# Altium schematic sheet driver-phase.SchDoc: Phase driver
size A3; SheetNumber: 19; SheetTotal: 21
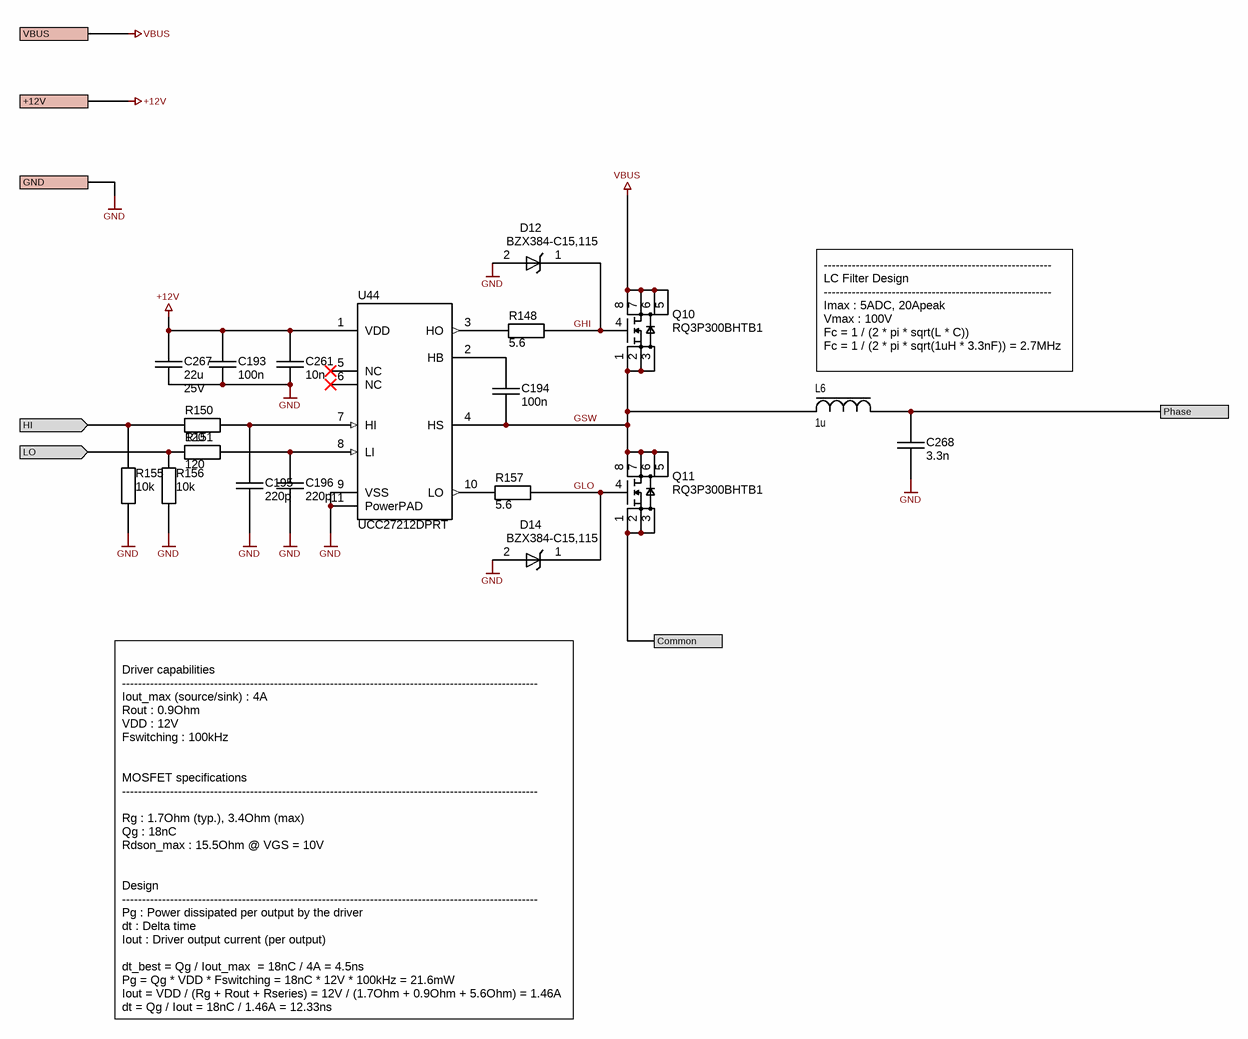
[diagram p0: driver-phase.SchDoc]

## Parts
C193  100n  [SM/C0402]
C194  100n  [SM/C0402]
C195  220p  [SM/C0402]
C196  220p  [SM/C0402]
C261  10n  [SM/C0402]
C267  22u  Voltage: 25V  [SM/C0805]
C268  3.3n  [SM/C0402]
D12  BZX384-C15,115  [SODFL250X110-2N]
D14  BZX384-C15,115  [SODFL250X110-2N]
L6  1u  [PA5005.102NLT]
Q10  RQ3P300BHTB1  [RQ3P300BHTB1]
Q11  RQ3P300BHTB1  [RQ3P300BHTB1]
R148  5.6  [SM/R0402]
R150  120  [SM/R0402]
R151  120  [SM/R0402]
R155  10k  [SM/R0402]
R156  10k  [SM/R0402]
R157  5.6  [SM/R0402]
U44  UCC27212DPRT  [PSON80P400X80_HS-11N]

## Ports
+12V, Common, GND, HI (in), LO (in), Phase, VBUS

## Nets
+12V: C193.2 C261.1 C267.2 U44.1(VDD) ; port +12V
GND: C193.1 C195.1 C196.1 C261.2 C267.1 C268.1 D12.2(A) D14.2(A) R155.2 R156.2 U44.9(VSS) U44.11(PowerPAD) ; port GND
VBUS: Q10.5(D) Q10.6(D) Q10.7(D) Q10.8(D) ; port VBUS
Common: Q11.1(S) Q11.2(S) Q11.3(S) ; port Common
GHI: D12.1(K) Q10.4(G) R148.2
GLO: D14.1(K) Q11.4(G) R157.1
GSW: C194.2 L6.1 Q10.1(S) Q10.2(S) Q10.3(S) Q11.5(D) Q11.6(D) Q11.7(D) Q11.8(D) U44.4(HS)
HI: R150.2 R155.1 ; port HI
LO: R151.2 R156.1 ; port LO
Phase: C268.2 L6.2 ; port Phase
NetC194_1: C194.1 U44.2(HB)
NetC195_2: C195.2 R150.1 U44.7(HI)
NetC196_2: C196.2 R151.1 U44.8(LI)
NetR148_1: R148.1 U44.3(HO)
NetR157_2: R157.2 U44.10(LO)

Not connected (* = marked no-connect by the designer): U44 5(NC)* 6(NC)*

## Notes on the sheet
- (near L6) ---------------------------------------------------------
  LC Filter Design
  ---------------------------------------------------------
  Imax : 5ADC, 20Apeak
  Vmax : 100V
  Fc = 1 / (2 * pi * sqrt(L * C))
  Fc = 1 / (2 * pi * sqrt(1uH * 3.3nF)) = 2.7MHz
- Driver capabilities
  --------------------------------------------------------------------------------------------------------
  Iout_max (source/sink) : 4A
  Rout : 0.9Ohm
  VDD : 12V
  Fswitching : 100kHz
  MOSFET specifications
  --------------------------------------------------------------------------------------------------------
  Rg : 1.7Ohm (typ.), 3.4Ohm (max)
  Qg : 18nC
  Rdson_max : 15.5Ohm @ VGS = 10V
  Design
  --------------------------------------------------------------------------------------------------------
  Pg : Power dissipated per output by the driver
  dt : Delta time
  Iout : Driver output current (per output)
  dt_best = Qg / Iout_max  = 18nC / 4A = 4.5ns
  Pg = Qg * VDD * Fswitching = 18nC * 12V * 100kHz = 21.6mW
  Iout = VDD / (Rg + Rout + Rseries) = 12V / (1.7Ohm + 0.9Ohm + 5.6Ohm) = 1.46A
  dt = Qg / Iout = 18nC / 1.46A = 12.33ns
- HES-SO / HEIG-VD / TIN / IAI
  Route de Cheseaux, 1
  CH-1401 Yverdon-les-Bains
  T +41 24 557 73 77    F +41 24 557 63 20
  http://iai.heig-vd.ch
  iai@heig-vd.ch
- Title
- Size
- Date
- A4
- Project
- Sheet
- of
- No.
- Author
- SVN/Git
- Version
- File

## Library data of the parts
C193 C194 = CAP CER 100NF 25V X5R 0402: 100 nF ±10% 25V Ceramic Capacitor X5R 0402 (1005 Metric); Voltage: 25V; Dielectric: X5R; Supplier 1: Digi-Key; Supplier Part Number 1: 1276-1043-1-ND; Value: 100n
C195 C196 = CAP CER 220PF 50V C0G/NP0 0402: 220 pF ±5% 50V Ceramic Capacitor C0G, NP0 0402 (1005 Metric); Dielectric: NPO; Voltage: 50V; Supplier 1: Digi-Key; Supplier Part Number 1: 1276-1059-1-ND; Value: 220p
C261 = CAP CER 10NF 50V X7R 0402: 10 nF ±10% 50V Ceramic Capacitor X7R 0402 (1005 Metric); Voltage: 50V; Dielectric: X7R; Supplier 1: Digi-Key; Supplier Part Number 1: 1276-1028-1-ND; Value: 10n
C267 = CAP CER 22UF 25V X5R 0805: 22 µF ±20% 25V Ceramic Capacitor X5R 0805 (2012 Metric); Dielectric: X5R; Supplier 1: Digi-Key; Supplier Part Number 1: 490-14661-1-ND
C268 = CAP CER 3.3NF 100V X8R 0402: 3.3 nF ±10% 100V Ceramic Capacitor X8R 0402 (1005 Metric); Voltage: 16V; Dielectric: X7R; Supplier 1: Digi-Key; Supplier Part Number 1: 445-15951-1-ND; Value: 3.3n
D12 D14 = DIODE ZENER 15V 300MW SOD323: Zener Diode 15 V 300 mW ±5% Surface Mount SOD-323; Mounting: SMD; Supplier 1: Digi-Key; Supplier Part Number 1: 1727-4986-1-ND
L6 = PA5005.102NLT: 1 µH Shielded Molded Inductor 20 A 4.52mOhm Max Nonstandard; Isat: 23A; Value: 1u; Supplier 1: Digi-Key; Supplier Part Number 1: 553-4098-1-ND
Q10 Q11 = RQ3P300BHTB1: N-Channel 100 V 39A (Ta) 2W (Ta) Surface Mount 8-HSMT (3.2x3); Supplier 1: Digi-Key; Supplier Part Number 1: 846-RQ3P300BHTB1CT-ND
R148 R157 = RES 5.6 OHM 5% 1/16W 0402: 5.6 Ohms ±5% 0.063W, 1/16W Chip Resistor 0402 (1005 Metric) Moisture Resistant Thick Film; Supplier 1: Digi-Key; Supplier Part Number 1: 311-5.6JRCT-ND; Value: 5.6
R150 R151 = RES 120 OHM 1% 1/16W 0402: 120 Ohms ±1% 0.063W, 1/16W Chip Resistor 0402 (1005 Metric) Moisture Resistant Thick Film; Supplier 1: Digi-Key; Supplier Part Number 1: 311-120LRCT-ND; Value: 120
R155 R156 = RES 10K OHM 1% 1/16W 0402: 10 kOhms ±1% 0.063W, 1/16W Chip Resistor 0402 (1005 Metric) Moisture Resistant Thick Film; Supplier 1: Digi-Key; Supplier Part Number 1: 1276-3431-1-ND; Value: 10k
U44 = UCC27212: Half-Bridge Gate Driver IC Non-Inverting 10-WSON (4x4); Supplier 1: Digi-Key; Supplier Part Number 1: 296-47091-1-ND